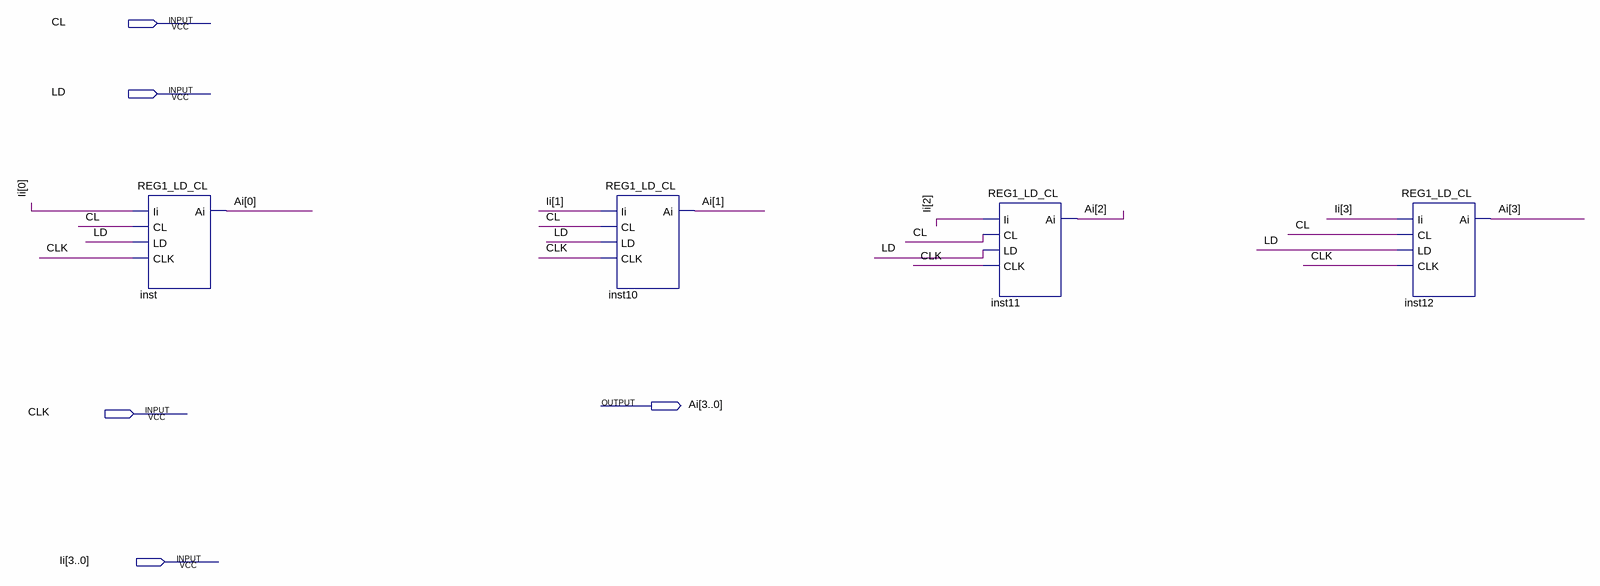
[diagram p0: schematic sheet]
// Quartus schematic REG4_LD_CL.bdf as structural Verilog: 4 symbols, 5 pins
module REG4_LD_CL (
  input  CL,
  input  LD,
  input  CLK,
  input  [3:0] Ii,
  output [3:0] Ai
);

  REG1_LD_CL inst (.Ii(Ii[0]), .CL(CL), .LD(LD), .CLK(CLK), .Ai(Ai[0]));
  REG1_LD_CL inst10 (.Ii(Ii[1]), .CL(CL), .LD(LD), .CLK(CLK), .Ai(Ai[1]));
  REG1_LD_CL inst11 (.Ii(Ii[2]), .CL(CL), .LD(LD), .CLK(CLK), .Ai(Ai[2]));
  REG1_LD_CL inst12 (.Ii(Ii[3]), .CL(CL), .LD(LD), .CLK(CLK), .Ai(Ai[3]));
endmodule
